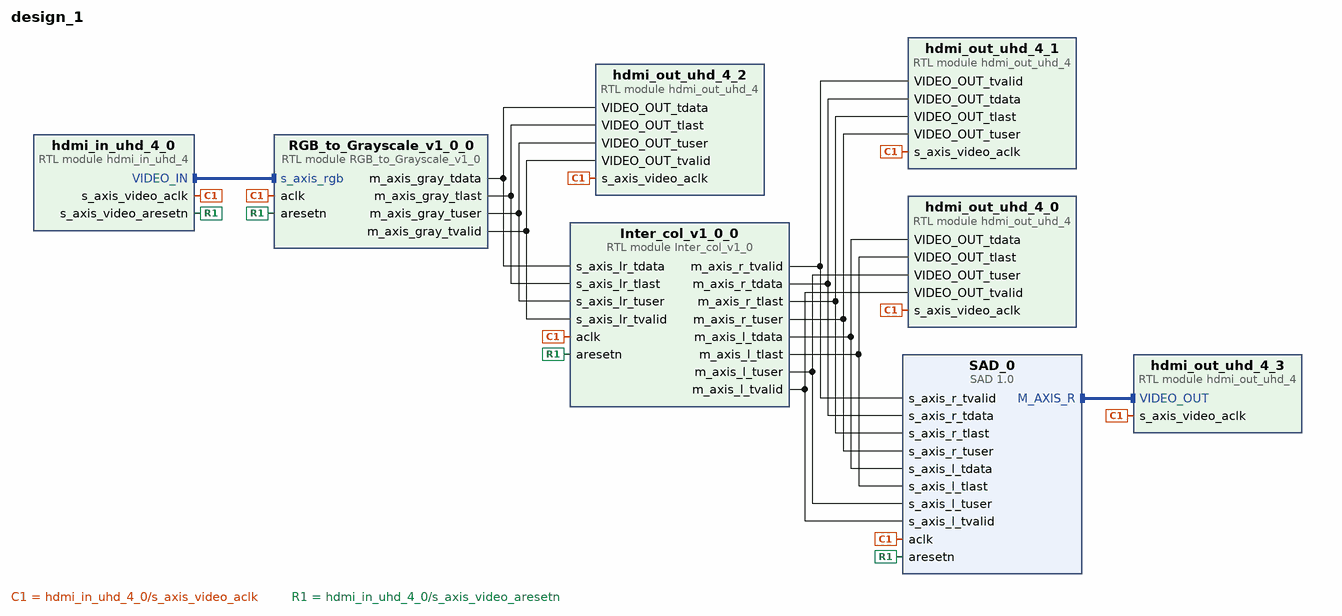
[diagram p0: block diagram of the top level]
# Vivado block design design_1, xczu7ev-ffvc1156-2-e, Vivado 2020.1
create_bd_design design_1

create_bd_cell -type module -reference hdmi_out_uhd_4 hdmi_out_uhd_4_0
set_property -dict {CONFIG.name outL} [get_bd_cells hdmi_out_uhd_4_0]
create_bd_cell -type module -reference hdmi_out_uhd_4 hdmi_out_uhd_4_1
set_property -dict {CONFIG.name outR} [get_bd_cells hdmi_out_uhd_4_1]
create_bd_cell -type module -reference hdmi_in_uhd_4 hdmi_in_uhd_4_0
create_bd_cell -type module -reference hdmi_out_uhd_4 hdmi_out_uhd_4_2
set_property -dict {CONFIG.name gray} [get_bd_cells hdmi_out_uhd_4_2]
create_bd_cell -type module -reference RGB_to_Grayscale_v1_0 RGB_to_Grayscale_v1_0_0
create_bd_cell -type module -reference Inter_col_v1_0 Inter_col_v1_0_0
create_bd_cell -type module -reference hdmi_out_uhd_4 hdmi_out_uhd_4_3
set_property -dict {CONFIG.name dispR} [get_bd_cells hdmi_out_uhd_4_3]
create_bd_cell -type ip -vlnv xilinx.com:user:SAD:1.0 SAD_0

# ---- connections ----

connect_bd_intf_net [get_bd_intf_pins hdmi_in_uhd_4_0/VIDEO_IN] [get_bd_intf_pins RGB_to_Grayscale_v1_0_0/s_axis_rgb]
connect_bd_intf_net [get_bd_intf_pins SAD_0/M_AXIS_R] [get_bd_intf_pins hdmi_out_uhd_4_3/VIDEO_OUT]
connect_bd_net [get_bd_pins hdmi_in_uhd_4_0/s_axis_video_aclk] \
  [get_bd_pins hdmi_out_uhd_4_0/s_axis_video_aclk] [get_bd_pins hdmi_out_uhd_4_1/s_axis_video_aclk] \
  [get_bd_pins hdmi_out_uhd_4_2/s_axis_video_aclk] [get_bd_pins RGB_to_Grayscale_v1_0_0/aclk] \
  [get_bd_pins Inter_col_v1_0_0/aclk] [get_bd_pins hdmi_out_uhd_4_3/s_axis_video_aclk] [get_bd_pins SAD_0/aclk]
connect_bd_net [get_bd_pins hdmi_in_uhd_4_0/s_axis_video_aresetn] \
  [get_bd_pins RGB_to_Grayscale_v1_0_0/aresetn] [get_bd_pins Inter_col_v1_0_0/aresetn] [get_bd_pins SAD_0/aresetn]
connect_bd_net [get_bd_pins RGB_to_Grayscale_v1_0_0/m_axis_gray_tdata] \
  [get_bd_pins hdmi_out_uhd_4_2/VIDEO_OUT_tdata] [get_bd_pins Inter_col_v1_0_0/s_axis_lr_tdata]
connect_bd_net [get_bd_pins RGB_to_Grayscale_v1_0_0/m_axis_gray_tlast] \
  [get_bd_pins hdmi_out_uhd_4_2/VIDEO_OUT_tlast] [get_bd_pins Inter_col_v1_0_0/s_axis_lr_tlast]
connect_bd_net [get_bd_pins RGB_to_Grayscale_v1_0_0/m_axis_gray_tuser] \
  [get_bd_pins hdmi_out_uhd_4_2/VIDEO_OUT_tuser] [get_bd_pins Inter_col_v1_0_0/s_axis_lr_tuser]
connect_bd_net [get_bd_pins RGB_to_Grayscale_v1_0_0/m_axis_gray_tvalid] \
  [get_bd_pins hdmi_out_uhd_4_2/VIDEO_OUT_tvalid] [get_bd_pins Inter_col_v1_0_0/s_axis_lr_tvalid]
connect_bd_net [get_bd_pins Inter_col_v1_0_0/m_axis_r_tvalid] [get_bd_pins hdmi_out_uhd_4_1/VIDEO_OUT_tvalid] [get_bd_pins SAD_0/s_axis_r_tvalid]
connect_bd_net [get_bd_pins Inter_col_v1_0_0/m_axis_r_tdata] [get_bd_pins hdmi_out_uhd_4_1/VIDEO_OUT_tdata] [get_bd_pins SAD_0/s_axis_r_tdata]
connect_bd_net [get_bd_pins Inter_col_v1_0_0/m_axis_r_tlast] [get_bd_pins hdmi_out_uhd_4_1/VIDEO_OUT_tlast] [get_bd_pins SAD_0/s_axis_r_tlast]
connect_bd_net [get_bd_pins Inter_col_v1_0_0/m_axis_r_tuser] [get_bd_pins hdmi_out_uhd_4_1/VIDEO_OUT_tuser] [get_bd_pins SAD_0/s_axis_r_tuser]
connect_bd_net [get_bd_pins Inter_col_v1_0_0/m_axis_l_tdata] [get_bd_pins hdmi_out_uhd_4_0/VIDEO_OUT_tdata] [get_bd_pins SAD_0/s_axis_l_tdata]
connect_bd_net [get_bd_pins Inter_col_v1_0_0/m_axis_l_tlast] [get_bd_pins hdmi_out_uhd_4_0/VIDEO_OUT_tlast] [get_bd_pins SAD_0/s_axis_l_tlast]
connect_bd_net [get_bd_pins Inter_col_v1_0_0/m_axis_l_tuser] [get_bd_pins hdmi_out_uhd_4_0/VIDEO_OUT_tuser] [get_bd_pins SAD_0/s_axis_l_tuser]
connect_bd_net [get_bd_pins Inter_col_v1_0_0/m_axis_l_tvalid] [get_bd_pins hdmi_out_uhd_4_0/VIDEO_OUT_tvalid] [get_bd_pins SAD_0/s_axis_l_tvalid]

validate_bd_design
save_bd_design
